# Altium schematic sheet Glucometer-I.C.- Mis 1.SchDoc
size Letter
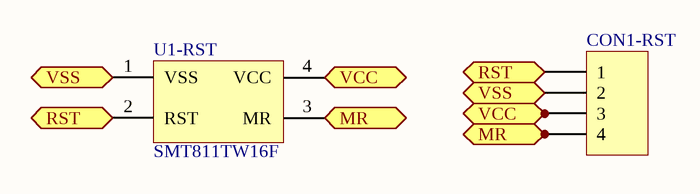
[diagram p0: Glucometer-I.C.- Mis 1.SchDoc]

## Parts
CON1-RST  Header 4  [HDR1X4]  (value not drawn)
U1-RST  SMT811TW16F  [SOT143]

## Ports
MR, RST, VCC, VSS

## Nets
MR: CON1-RST.4 U1-RST.3(MR) ; port MR
RST: CON1-RST.1 U1-RST.2(RST) ; port RST
VCC: CON1-RST.3 U1-RST.4(VCC) ; port VCC
VSS: CON1-RST.2 U1-RST.1(VSS) ; port VSS

## Library data of the parts
CON1-RST = Header 4: Header, 4-Pin; LatestRevisionDate: 17-Jul-2002; LatestRevisionNote: Re-released for DXP Platform.; Publisher: Altium Limited
U1-RST = SMT811TW16F: Reset Circuit, 3.08V, Push Pull Inverted RST